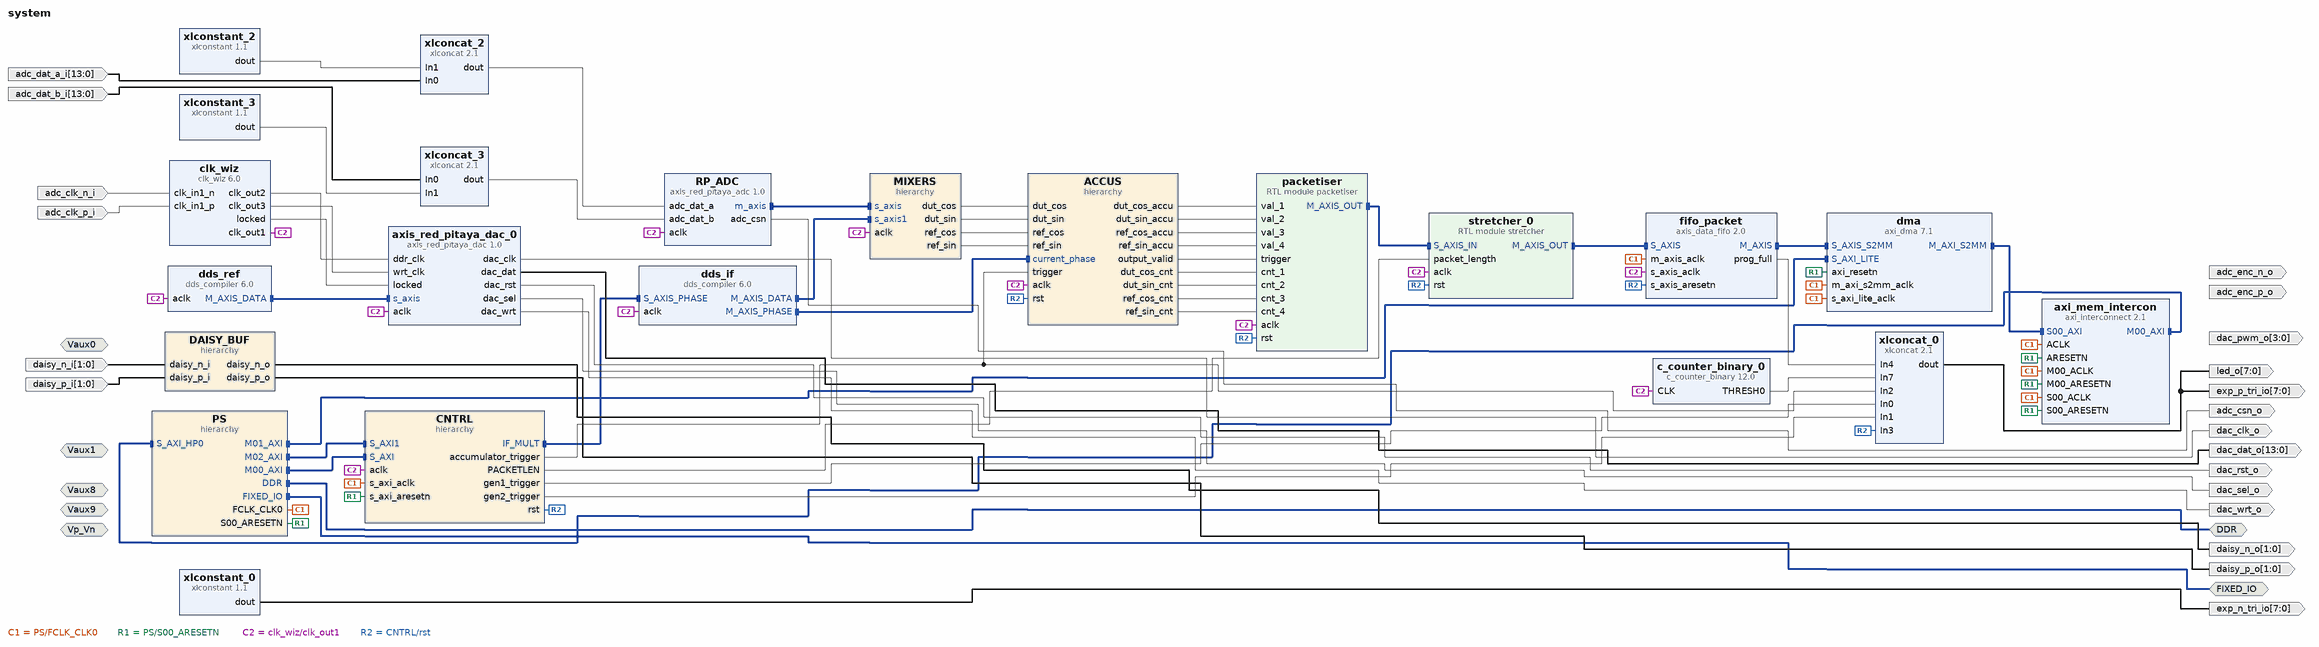
[diagram p0: block diagram of the top level]
# Vivado block design system, xc7z010iclg400-1L, Vivado 2023.2
create_bd_design system

create_bd_intf_port -mode Slave -vlnv xilinx.com:interface:diff_analog_io_rtl:1.0 Vp_Vn
create_bd_intf_port -mode Slave -vlnv xilinx.com:interface:diff_analog_io_rtl:1.0 Vaux0
create_bd_intf_port -mode Slave -vlnv xilinx.com:interface:diff_analog_io_rtl:1.0 Vaux1
create_bd_intf_port -mode Slave -vlnv xilinx.com:interface:diff_analog_io_rtl:1.0 Vaux9
create_bd_intf_port -mode Slave -vlnv xilinx.com:interface:diff_analog_io_rtl:1.0 Vaux8
create_bd_intf_port -mode Master -vlnv xilinx.com:interface:ddrx_rtl:1.0 DDR
create_bd_intf_port -mode Master -vlnv xilinx.com:display_processing_system7:fixedio_rtl:1.0 FIXED_IO
create_bd_port -dir I -from 13 -to 0 adc_dat_a_i
create_bd_port -dir I -from 13 -to 0 adc_dat_b_i
create_bd_port -dir I adc_clk_p_i
create_bd_port -dir I adc_clk_n_i
create_bd_port -dir O adc_enc_p_o
create_bd_port -dir O adc_enc_n_o
create_bd_port -dir O adc_csn_o
create_bd_port -dir O -from 13 -to 0 dac_dat_o
create_bd_port -dir O dac_clk_o
create_bd_port -dir O dac_rst_o
create_bd_port -dir O dac_sel_o
create_bd_port -dir O dac_wrt_o
create_bd_port -dir O -from 3 -to 0 dac_pwm_o
create_bd_port -dir O -from 1 -to 0 daisy_p_o
create_bd_port -dir O -from 1 -to 0 daisy_n_o
create_bd_port -dir I -from 1 -to 0 daisy_p_i
create_bd_port -dir I -from 1 -to 0 daisy_n_i
create_bd_port -dir O -from 7 -to 0 led_o
create_bd_port -dir O -from 7 -to 0 exp_n_tri_io
create_bd_port -dir O -from 7 -to 0 exp_p_tri_io

create_bd_cell -type ip -vlnv pavel-demin:user:axis_red_pitaya_adc:1.0 RP_ADC
create_bd_cell -type hier PS
create_bd_cell -type hier DAISY_BUF
create_bd_cell -type ip -vlnv xilinx.com:ip:axi_dma:7.1 dma
set_property -dict {CONFIG.c_include_mm2s 0 CONFIG.c_include_sg 0 CONFIG.c_m_axi_s2mm_data_width 64} [get_bd_cells dma]
create_bd_cell -type ip -vlnv xilinx.com:ip:axis_data_fifo:2.0 fifo_packet
set_property -dict [list \
  CONFIG.FIFO_DEPTH 32768 \
  CONFIG.FIFO_MODE 2 \
  CONFIG.HAS_PROG_FULL 1 \
  CONFIG.HAS_RD_DATA_COUNT 0 \
  CONFIG.HAS_WR_DATA_COUNT 0 \
  CONFIG.IS_ACLK_ASYNC 1 \
  CONFIG.PROG_FULL_THRESH 30000 \
] [get_bd_cells fifo_packet]
create_bd_cell -type ip -vlnv xilinx.com:ip:dds_compiler:6.0 dds_if
set_property -dict [list \
  CONFIG.DATA_Has_TLAST Not_Required \
  CONFIG.DDS_Clock_Rate 125 \
  CONFIG.Frequency_Resolution 488281 \
  CONFIG.Latency 5 \
  CONFIG.Mode_of_Operation Rasterized \
  CONFIG.Modulus 256 \
  CONFIG.Negative_Sine true \
  CONFIG.Noise_Shaping None \
  CONFIG.Output_Frequency1 0 \
  CONFIG.Output_Width 14 \
  CONFIG.PINC1 0 \
  CONFIG.Parameter_Entry Hardware_Parameters \
  CONFIG.Phase_Increment Streaming \
  CONFIG.Phase_Width 8 \
  CONFIG.S_PHASE_Has_TUSER Not_Required \
] [get_bd_cells dds_if]
create_bd_cell -type ip -vlnv xilinx.com:ip:dds_compiler:6.0 dds_ref
set_property -dict [list \
  CONFIG.DDS_Clock_Rate 125 \
  CONFIG.Frequency_Resolution 5000000 \
  CONFIG.Has_Phase_Out false \
  CONFIG.Latency 5 \
  CONFIG.M_DATA_Has_TUSER Not_Required \
  CONFIG.Mode_of_Operation Rasterized \
  CONFIG.Modulus 25 \
  CONFIG.Negative_Sine true \
  CONFIG.Noise_Shaping None \
  CONFIG.Output_Frequency1 0 \
  CONFIG.Output_Selection Sine_and_Cosine \
  CONFIG.Output_Width 14 \
  CONFIG.PINC1 10 \
  CONFIG.Parameter_Entry Hardware_Parameters \
  CONFIG.Phase_Width 5 \
] [get_bd_cells dds_ref]
create_bd_cell -type hier MIXERS
create_bd_cell -type hier ACCUS
create_bd_cell -type module -reference packetiser packetiser
create_bd_cell -type ip -vlnv xilinx.com:ip:xlconcat:2.1 xlconcat_0
set_property -dict [list \
  CONFIG.IN0_WIDTH 1 \
  CONFIG.IN1_WIDTH 1 \
  CONFIG.IN2_WIDTH 1 \
  CONFIG.IN3_WIDTH 1 \
  CONFIG.IN4_WIDTH 1 \
  CONFIG.IN5_WIDTH 1 \
  CONFIG.IN6_WIDTH 1 \
  CONFIG.IN7_WIDTH 1 \
  CONFIG.NUM_PORTS 8 \
  CONFIG.dout_width 8 \
] [get_bd_cells xlconcat_0]
create_bd_cell -type ip -vlnv xilinx.com:ip:axi_interconnect:2.1 axi_mem_intercon
set_property -dict {CONFIG.NUM_MI 1} [get_bd_cells axi_mem_intercon]
create_bd_cell -type hier CNTRL
create_bd_cell -type ip -vlnv xilinx.com:ip:c_counter_binary:12.0 c_counter_binary_0
set_property -dict [list \
  CONFIG.Final_Count_Value 18 \
  CONFIG.Latency_Configuration Manual \
  CONFIG.Output_Width 5 \
  CONFIG.Restrict_Count true \
  CONFIG.Sync_Threshold_Output true \
  CONFIG.Threshold_Value C \
] [get_bd_cells c_counter_binary_0]
create_bd_cell -type module -reference stretcher stretcher_0
create_bd_cell -type ip -vlnv xilinx.com:ip:xlconstant:1.1 xlconstant_0
set_property -dict {CONFIG.CONST_VAL 0 CONFIG.CONST_WIDTH 8} [get_bd_cells xlconstant_0]
create_bd_cell -type ip -vlnv xilinx.com:ip:clk_wiz:6.0 clk_wiz
set_property -dict [list \
  CONFIG.CLKIN1_JITTER_PS 80.0 \
  CONFIG.CLKOUT1_JITTER 119.348 \
  CONFIG.CLKOUT1_PHASE_ERROR 96.948 \
  CONFIG.CLKOUT1_REQUESTED_OUT_FREQ 125.000 \
  CONFIG.CLKOUT2_JITTER 104.759 \
  CONFIG.CLKOUT2_PHASE_ERROR 96.948 \
  CONFIG.CLKOUT2_REQUESTED_OUT_FREQ 250.000 \
  CONFIG.CLKOUT2_REQUESTED_PHASE 157.5 \
  CONFIG.CLKOUT2_USED true \
  CONFIG.CLKOUT3_JITTER 104.759 \
  CONFIG.CLKOUT3_PHASE_ERROR 96.948 \
  CONFIG.CLKOUT3_REQUESTED_OUT_FREQ 250.000 \
  CONFIG.CLKOUT3_REQUESTED_PHASE 202.5 \
  CONFIG.CLKOUT3_USED true \
  CONFIG.MMCM_CLKFBOUT_MULT_F 8.000 \
  CONFIG.MMCM_CLKIN1_PERIOD 8.000 \
  CONFIG.MMCM_CLKOUT0_DIVIDE_F 8.000 \
  CONFIG.MMCM_CLKOUT1_DIVIDE 4 \
  CONFIG.MMCM_CLKOUT1_PHASE 157.500 \
  CONFIG.MMCM_CLKOUT2_DIVIDE 4 \
  CONFIG.MMCM_CLKOUT2_PHASE 202.500 \
  CONFIG.NUM_OUT_CLKS 3 \
  CONFIG.PRIM_IN_FREQ 125.000 \
  CONFIG.PRIM_SOURCE Differential_clock_capable_pin \
  CONFIG.USE_RESET false \
] [get_bd_cells clk_wiz]
create_bd_cell -type ip -vlnv pavel-demin:user:axis_red_pitaya_dac:1.0 axis_red_pitaya_dac_0
create_bd_cell -type ip -vlnv xilinx.com:ip:xlconcat:2.1 xlconcat_2
create_bd_cell -type ip -vlnv xilinx.com:ip:xlconstant:1.1 xlconstant_2
set_property -dict {CONFIG.CONST_VAL 0 CONFIG.CONST_WIDTH 2} [get_bd_cells xlconstant_2]
create_bd_cell -type ip -vlnv xilinx.com:ip:xlconcat:2.1 xlconcat_3
create_bd_cell -type ip -vlnv xilinx.com:ip:xlconstant:1.1 xlconstant_3
set_property -dict {CONFIG.CONST_VAL 0 CONFIG.CONST_WIDTH 2} [get_bd_cells xlconstant_3]

# ---- hierarchy /PS ----
current_bd_instance /PS
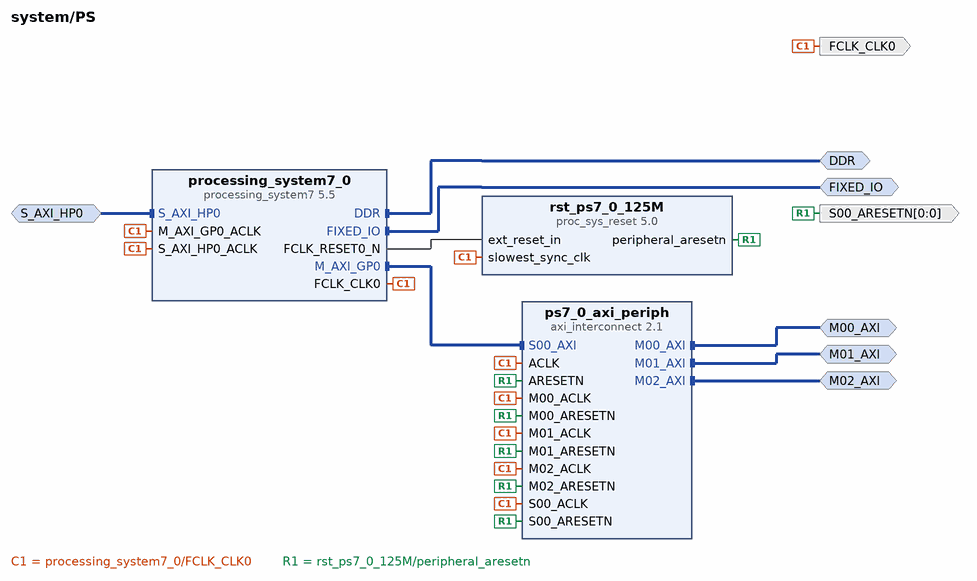
[diagram p1: block diagram inside /PS]
create_bd_intf_pin -mode Master -vlnv xilinx.com:interface:ddrx_rtl:1.0 DDR
create_bd_intf_pin -mode Master -vlnv xilinx.com:display_processing_system7:fixedio_rtl:1.0 FIXED_IO
create_bd_intf_pin -mode Master -vlnv xilinx.com:interface:aximm_rtl:1.0 M00_AXI
create_bd_intf_pin -mode Master -vlnv xilinx.com:interface:aximm_rtl:1.0 M01_AXI
create_bd_intf_pin -mode Slave -vlnv xilinx.com:interface:aximm_rtl:1.0 S_AXI_HP0
create_bd_intf_pin -mode Master -vlnv xilinx.com:interface:aximm_rtl:1.0 M02_AXI
create_bd_pin -dir O -type clk FCLK_CLK0
create_bd_pin -dir O -from 0 -to 0 -type rst S00_ARESETN

create_bd_cell -type ip -vlnv xilinx.com:ip:processing_system7:5.5 processing_system7_0
set_property -dict [list \
  CONFIG.PCW_APU_PERIPHERAL_FREQMHZ 666.666666 \
  CONFIG.PCW_DM_WIDTH 2 \
  CONFIG.PCW_DQS_WIDTH 2 \
  CONFIG.PCW_DQ_WIDTH 16 \
  CONFIG.PCW_ENET0_ENET0_IO EMIO \
  CONFIG.PCW_ENET0_GRP_MDIO_ENABLE 1 \
  CONFIG.PCW_ENET0_GRP_MDIO_IO EMIO \
  CONFIG.PCW_ENET0_PERIPHERAL_ENABLE 1 \
  CONFIG.PCW_ENET0_RESET_ENABLE 0 \
  CONFIG.PCW_ENET_RESET_ENABLE 1 \
  CONFIG.PCW_ENET_RESET_SELECT {Share reset pin} \
  CONFIG.PCW_FPGA0_PERIPHERAL_FREQMHZ 125 \
  CONFIG.PCW_FPGA1_PERIPHERAL_FREQMHZ 250 \
  CONFIG.PCW_FPGA3_PERIPHERAL_FREQMHZ 200 \
  CONFIG.PCW_GPIO_MIO_GPIO_ENABLE 1 \
  CONFIG.PCW_GPIO_MIO_GPIO_IO MIO \
  CONFIG.PCW_GPIO_PERIPHERAL_ENABLE 1 \
  CONFIG.PCW_I2C0_I2C0_IO EMIO \
  CONFIG.PCW_I2C0_PERIPHERAL_ENABLE 1 \
  CONFIG.PCW_I2C_PERIPHERAL_FREQMHZ 111.111115 \
  CONFIG.PCW_I2C_RESET_ENABLE 1 \
  CONFIG.PCW_I2C_RESET_SELECT {Share reset pin} \
  CONFIG.PCW_IMPORT_BOARD_PRESET cfg/red_pitaya.xml \
  CONFIG.PCW_MIO_PRIMITIVE 32 \
  CONFIG.PCW_PERIPHERAL_BOARD_PRESET None \
  CONFIG.PCW_PRESET_BANK1_VOLTAGE {LVCMOS 2.5V} \
  CONFIG.PCW_QSPI_GRP_SINGLE_SS_ENABLE 1 \
  CONFIG.PCW_QSPI_GRP_SINGLE_SS_IO {MIO 1 .. 6} \
  CONFIG.PCW_QSPI_PERIPHERAL_ENABLE 1 \
  CONFIG.PCW_QSPI_PERIPHERAL_FREQMHZ 125 \
  CONFIG.PCW_QSPI_QSPI_IO {MIO 1 .. 6} \
  CONFIG.PCW_SD0_PERIPHERAL_ENABLE 1 \
  CONFIG.PCW_SD0_SD0_IO EMIO \
  CONFIG.PCW_SDIO_PERIPHERAL_FREQMHZ 100 \
  CONFIG.PCW_SINGLE_QSPI_DATA_MODE x4 \
  CONFIG.PCW_SPI0_PERIPHERAL_ENABLE 1 \
  CONFIG.PCW_SPI0_SPI0_IO EMIO \
  CONFIG.PCW_SPI1_PERIPHERAL_ENABLE 1 \
  CONFIG.PCW_SPI1_SPI1_IO {MIO 10 .. 15} \
  CONFIG.PCW_TTC0_PERIPHERAL_ENABLE 1 \
  CONFIG.PCW_TTC0_TTC0_IO EMIO \
  CONFIG.PCW_UART0_PERIPHERAL_ENABLE 1 \
  CONFIG.PCW_UART0_UART0_IO {MIO 14 .. 15} \
  CONFIG.PCW_UART1_PERIPHERAL_ENABLE 1 \
  CONFIG.PCW_UART1_UART1_IO {MIO 8 .. 9} \
  CONFIG.PCW_UART_PERIPHERAL_FREQMHZ 100 \
  CONFIG.PCW_UIPARAM_DDR_BUS_WIDTH {16 Bit} \
  CONFIG.PCW_UIPARAM_DDR_FREQ_MHZ 533.333333 \
  CONFIG.PCW_UIPARAM_DDR_PARTNO {MT41J256M16 RE-125} \
  CONFIG.PCW_USB0_PERIPHERAL_ENABLE 1 \
  CONFIG.PCW_USB0_RESET_ENABLE 1 \
  CONFIG.PCW_USB0_RESET_IO {MIO 48} \
  CONFIG.PCW_USB0_USB0_IO {MIO 28 .. 39} \
  CONFIG.PCW_USB_RESET_ENABLE 1 \
  CONFIG.PCW_USB_RESET_SELECT {Share reset pin} \
  CONFIG.PCW_USE_S_AXI_HP0 1 \
] [get_bd_cells processing_system7_0]
# 505 more settings of processing_system7_0 are not shown: defaults, MIO pin electricals, DDR timing, and values the tool derives
create_bd_cell -type ip -vlnv xilinx.com:ip:proc_sys_reset:5.0 rst_ps7_0_125M
create_bd_cell -type ip -vlnv xilinx.com:ip:axi_interconnect:2.1 ps7_0_axi_periph
set_property -dict {CONFIG.NUM_MI 3} [get_bd_cells ps7_0_axi_periph]

# ---- hierarchy /DAISY_BUF ----
current_bd_instance /DAISY_BUF
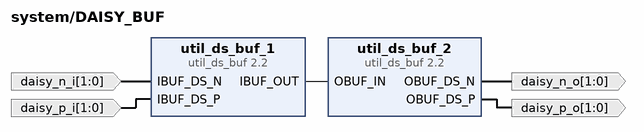
[diagram p2: block diagram inside /DAISY_BUF]
create_bd_pin -dir I -from 1 -to 0 daisy_p_i
create_bd_pin -dir I -from 1 -to 0 daisy_n_i
create_bd_pin -dir O -from 1 -to 0 -type clk daisy_p_o
create_bd_pin -dir O -from 1 -to 0 -type clk daisy_n_o

create_bd_cell -type ip -vlnv xilinx.com:ip:util_ds_buf:2.2 util_ds_buf_1
set_property -dict {CONFIG.C_SIZE 2} [get_bd_cells util_ds_buf_1]
create_bd_cell -type ip -vlnv xilinx.com:ip:util_ds_buf:2.2 util_ds_buf_2
set_property -dict {CONFIG.C_BUF_TYPE OBUFDS CONFIG.C_SIZE 2} [get_bd_cells util_ds_buf_2]

# ---- hierarchy /MIXERS ----
current_bd_instance /MIXERS
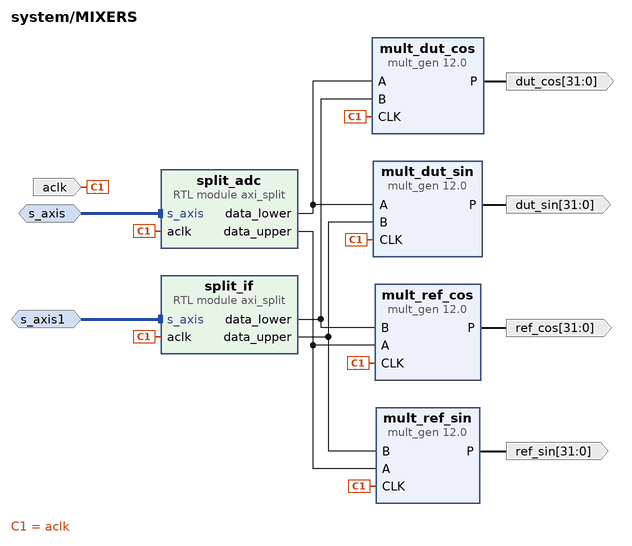
[diagram p3: block diagram inside /MIXERS]
create_bd_intf_pin -mode Slave -vlnv xilinx.com:interface:axis_rtl:1.0 s_axis
create_bd_intf_pin -mode Slave -vlnv xilinx.com:interface:axis_rtl:1.0 s_axis1
create_bd_pin -dir I -type clk aclk
create_bd_pin -dir O -from 31 -to 0 -type data dut_cos
create_bd_pin -dir O -from 31 -to 0 -type data ref_cos
create_bd_pin -dir O -from 31 -to 0 -type data ref_sin
create_bd_pin -dir O -from 31 -to 0 -type data dut_sin

create_bd_cell -type module -reference axi_split split_adc
create_bd_cell -type module -reference axi_split split_if
create_bd_cell -type ip -vlnv xilinx.com:ip:mult_gen:12.0 mult_ref_cos
set_property -dict [list \
  CONFIG.Multiplier_Construction Use_Mults \
  CONFIG.OptGoal Speed \
  CONFIG.OutputWidthHigh 31 \
  CONFIG.PipeStages 3 \
  CONFIG.PortAType Signed \
  CONFIG.PortAWidth 14 \
  CONFIG.PortBType Signed \
  CONFIG.PortBWidth 14 \
  CONFIG.Use_Custom_Output_Width true \
] [get_bd_cells mult_ref_cos]
create_bd_cell -type ip -vlnv xilinx.com:ip:mult_gen:12.0 mult_ref_sin
set_property -dict [list \
  CONFIG.Multiplier_Construction Use_Mults \
  CONFIG.OptGoal Speed \
  CONFIG.OutputWidthHigh 31 \
  CONFIG.PipeStages 3 \
  CONFIG.PortAType Signed \
  CONFIG.PortAWidth 14 \
  CONFIG.PortBType Signed \
  CONFIG.PortBWidth 14 \
  CONFIG.Use_Custom_Output_Width true \
] [get_bd_cells mult_ref_sin]
create_bd_cell -type ip -vlnv xilinx.com:ip:mult_gen:12.0 mult_dut_cos
set_property -dict [list \
  CONFIG.Multiplier_Construction Use_Mults \
  CONFIG.OptGoal Speed \
  CONFIG.OutputWidthHigh 31 \
  CONFIG.PipeStages 3 \
  CONFIG.PortAType Signed \
  CONFIG.PortAWidth 14 \
  CONFIG.PortBType Signed \
  CONFIG.PortBWidth 14 \
  CONFIG.Use_Custom_Output_Width true \
] [get_bd_cells mult_dut_cos]
create_bd_cell -type ip -vlnv xilinx.com:ip:mult_gen:12.0 mult_dut_sin
set_property -dict [list \
  CONFIG.Multiplier_Construction Use_Mults \
  CONFIG.OptGoal Speed \
  CONFIG.OutputWidthHigh 31 \
  CONFIG.PipeStages 3 \
  CONFIG.PortAType Signed \
  CONFIG.PortAWidth 14 \
  CONFIG.PortBType Signed \
  CONFIG.PortBWidth 14 \
  CONFIG.Use_Custom_Output_Width true \
] [get_bd_cells mult_dut_sin]

# ---- hierarchy /ACCUS ----
current_bd_instance /ACCUS
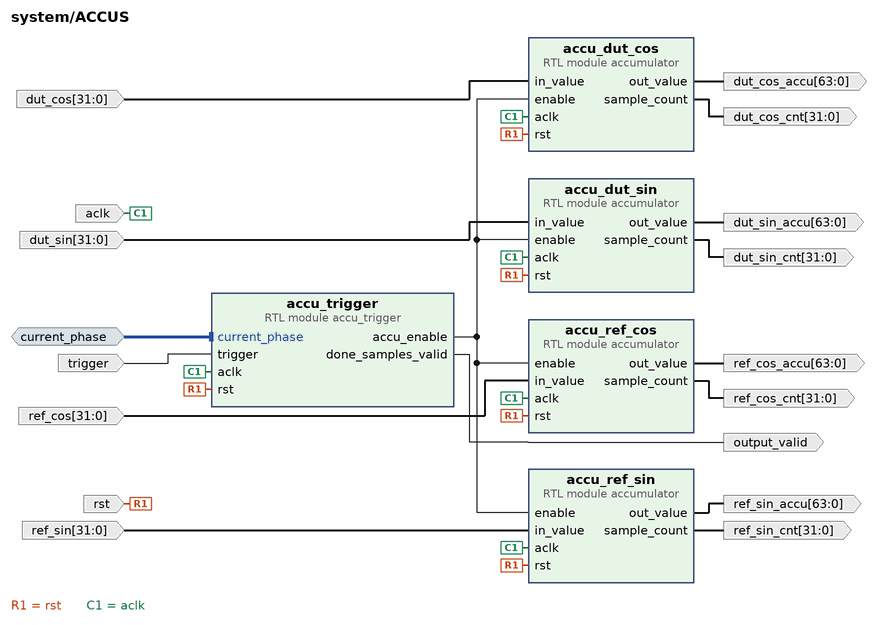
[diagram p4: block diagram inside /ACCUS]
create_bd_intf_pin -mode Slave -vlnv xilinx.com:interface:axis_rtl:1.0 current_phase
create_bd_pin -dir I -type clk aclk
create_bd_pin -dir O -from 63 -to 0 dut_cos_accu
create_bd_pin -dir O -from 31 -to 0 dut_cos_cnt
create_bd_pin -dir O -from 63 -to 0 dut_sin_accu
create_bd_pin -dir O -from 31 -to 0 dut_sin_cnt
create_bd_pin -dir O -from 63 -to 0 ref_cos_accu
create_bd_pin -dir O -from 31 -to 0 ref_cos_cnt
create_bd_pin -dir O -from 63 -to 0 ref_sin_accu
create_bd_pin -dir O -from 31 -to 0 ref_sin_cnt
create_bd_pin -dir O output_valid
create_bd_pin -dir I -from 31 -to 0 -type data dut_cos
create_bd_pin -dir I -from 31 -to 0 -type data dut_sin
create_bd_pin -dir I -from 31 -to 0 -type data ref_cos
create_bd_pin -dir I -from 31 -to 0 -type data ref_sin
create_bd_pin -dir I -type rst rst
create_bd_pin -dir I trigger

create_bd_cell -type module -reference accumulator accu_dut_cos
create_bd_cell -type module -reference accumulator accu_dut_sin
create_bd_cell -type module -reference accumulator accu_ref_sin
create_bd_cell -type module -reference accu_trigger accu_trigger
create_bd_cell -type module -reference accumulator accu_ref_cos

# ---- hierarchy /CNTRL ----
current_bd_instance /CNTRL
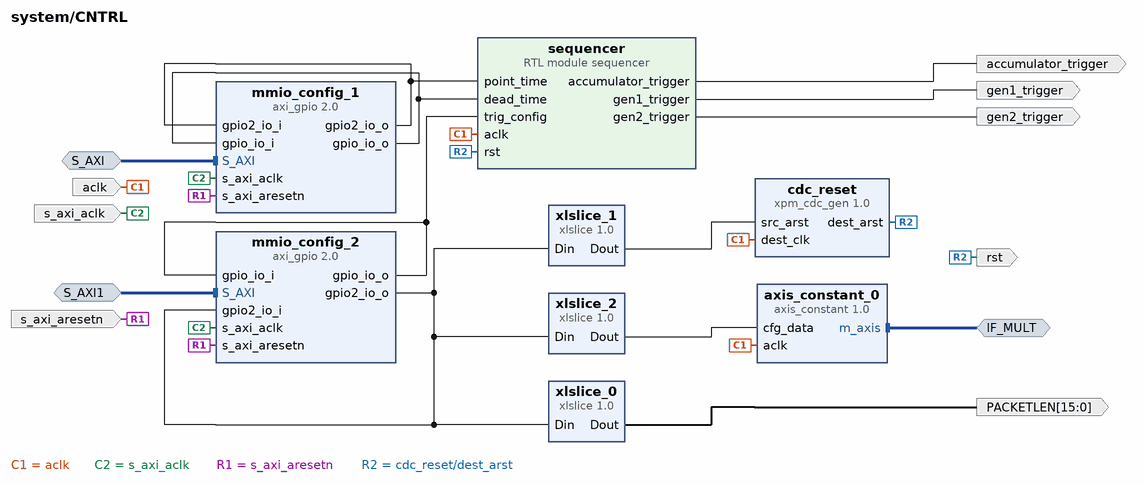
[diagram p5: block diagram inside /CNTRL]
create_bd_intf_pin -mode Slave -vlnv xilinx.com:interface:aximm_rtl:1.0 S_AXI
create_bd_intf_pin -mode Slave -vlnv xilinx.com:interface:aximm_rtl:1.0 S_AXI1
create_bd_intf_pin -mode Master -vlnv xilinx.com:interface:axis_rtl:1.0 IF_MULT
create_bd_pin -dir I -type clk aclk
create_bd_pin -dir O -type rst rst
create_bd_pin -dir I -type clk s_axi_aclk
create_bd_pin -dir I -type rst s_axi_aresetn
create_bd_pin -dir O gen1_trigger
create_bd_pin -dir O gen2_trigger
create_bd_pin -dir O accumulator_trigger
create_bd_pin -dir O -from 15 -to 0 PACKETLEN

create_bd_cell -type ip -vlnv xilinx.com:ip:xlslice:1.0 xlslice_1
create_bd_cell -type ip -vlnv xilinx.com:ip:xpm_cdc_gen:1.0 cdc_reset
set_property -dict {CONFIG.CDC_TYPE xpm_cdc_async_rst CONFIG.INIT_SYNC_FF false} [get_bd_cells cdc_reset]
create_bd_cell -type ip -vlnv xilinx.com:ip:axi_gpio:2.0 mmio_config_1
set_property -dict [list \
  CONFIG.C_ALL_INPUTS_2 0 \
  CONFIG.C_ALL_OUTPUTS_2 0 \
  CONFIG.C_DOUT_DEFAULT 0x00007A12 \
  CONFIG.C_DOUT_DEFAULT_2 0x0001E848 \
  CONFIG.C_IS_DUAL 1 \
] [get_bd_cells mmio_config_1]
create_bd_cell -type ip -vlnv xilinx.com:ip:axi_gpio:2.0 mmio_config_2
set_property -dict [list \
  CONFIG.C_DOUT_DEFAULT 0x250004E2 \
  CONFIG.C_DOUT_DEFAULT_2 0x00011000 \
  CONFIG.C_IS_DUAL 1 \
] [get_bd_cells mmio_config_2]
create_bd_cell -type module -reference sequencer sequencer
create_bd_cell -type ip -vlnv xilinx.com:ip:xlslice:1.0 xlslice_0
set_property -dict {CONFIG.DIN_FROM 31 CONFIG.DIN_TO 16 CONFIG.DOUT_WIDTH 16} [get_bd_cells xlslice_0]
create_bd_cell -type ip -vlnv xilinx.com:ip:xlslice:1.0 xlslice_2
set_property -dict {CONFIG.DIN_FROM 15 CONFIG.DIN_TO 8 CONFIG.DOUT_WIDTH 8} [get_bd_cells xlslice_2]
create_bd_cell -type ip -vlnv pavel-demin:user:axis_constant:1.0 axis_constant_0
set_property -dict {CONFIG.AXIS_TDATA_WIDTH 8} [get_bd_cells axis_constant_0]

# ---- connections ----

current_bd_instance /PS
connect_bd_intf_net [get_bd_intf_pins ps7_0_axi_periph/M01_AXI] [get_bd_intf_pins M01_AXI]
connect_bd_intf_net [get_bd_intf_pins processing_system7_0/S_AXI_HP0] [get_bd_intf_pins S_AXI_HP0]
connect_bd_intf_net [get_bd_intf_pins ps7_0_axi_periph/M02_AXI] [get_bd_intf_pins M02_AXI]
connect_bd_intf_net [get_bd_intf_pins DDR] [get_bd_intf_pins processing_system7_0/DDR]
connect_bd_intf_net [get_bd_intf_pins FIXED_IO] [get_bd_intf_pins processing_system7_0/FIXED_IO]
connect_bd_intf_net [get_bd_intf_pins processing_system7_0/M_AXI_GP0] [get_bd_intf_pins ps7_0_axi_periph/S00_AXI]
connect_bd_intf_net [get_bd_intf_pins M00_AXI] [get_bd_intf_pins ps7_0_axi_periph/M00_AXI]
connect_bd_net [get_bd_pins processing_system7_0/FCLK_CLK0] \
  [get_bd_pins FCLK_CLK0] [get_bd_pins processing_system7_0/M_AXI_GP0_ACLK] [get_bd_pins processing_system7_0/S_AXI_HP0_ACLK] \
  [get_bd_pins ps7_0_axi_periph/ACLK] [get_bd_pins ps7_0_axi_periph/S00_ACLK] [get_bd_pins ps7_0_axi_periph/M00_ACLK] \
  [get_bd_pins ps7_0_axi_periph/M01_ACLK] [get_bd_pins ps7_0_axi_periph/M02_ACLK] \
  [get_bd_pins rst_ps7_0_125M/slowest_sync_clk]
connect_bd_net [get_bd_pins processing_system7_0/FCLK_RESET0_N] [get_bd_pins rst_ps7_0_125M/ext_reset_in]
connect_bd_net [get_bd_pins rst_ps7_0_125M/peripheral_aresetn] \
  [get_bd_pins S00_ARESETN] [get_bd_pins ps7_0_axi_periph/ARESETN] [get_bd_pins ps7_0_axi_periph/S00_ARESETN] \
  [get_bd_pins ps7_0_axi_periph/M00_ARESETN] [get_bd_pins ps7_0_axi_periph/M01_ARESETN] \
  [get_bd_pins ps7_0_axi_periph/M02_ARESETN]

current_bd_instance /DAISY_BUF
connect_bd_net [get_bd_pins daisy_n_i] [get_bd_pins util_ds_buf_1/IBUF_DS_N]
connect_bd_net [get_bd_pins daisy_p_i] [get_bd_pins util_ds_buf_1/IBUF_DS_P]
connect_bd_net [get_bd_pins util_ds_buf_1/IBUF_OUT] [get_bd_pins util_ds_buf_2/OBUF_IN]
connect_bd_net [get_bd_pins util_ds_buf_2/OBUF_DS_N] [get_bd_pins daisy_n_o]
connect_bd_net [get_bd_pins util_ds_buf_2/OBUF_DS_P] [get_bd_pins daisy_p_o]

current_bd_instance /MIXERS
connect_bd_intf_net -intf_net RP_ADC_M_AXIS [get_bd_intf_pins s_axis] [get_bd_intf_pins split_adc/s_axis]
connect_bd_intf_net -intf_net dds_if_M_AXIS_DATA [get_bd_intf_pins s_axis1] [get_bd_intf_pins split_if/s_axis]
connect_bd_net -net axis_red_pitaya_adc_0_adc_clk [get_bd_pins aclk] \
  [get_bd_pins mult_dut_cos/CLK] [get_bd_pins mult_dut_sin/CLK] [get_bd_pins mult_ref_cos/CLK] [get_bd_pins mult_ref_sin/CLK] \
  [get_bd_pins split_adc/aclk] [get_bd_pins split_if/aclk]
connect_bd_net [get_bd_pins mult_dut_cos/P] [get_bd_pins dut_cos]
connect_bd_net [get_bd_pins mult_dut_sin/P] [get_bd_pins dut_sin]
connect_bd_net [get_bd_pins mult_ref_cos/P] [get_bd_pins ref_cos]
connect_bd_net [get_bd_pins mult_ref_sin/P] [get_bd_pins ref_sin]
connect_bd_net [get_bd_pins split_adc/data_lower] [get_bd_pins mult_dut_cos/A] [get_bd_pins mult_dut_sin/A]
connect_bd_net [get_bd_pins split_adc/data_upper] [get_bd_pins mult_ref_cos/A] [get_bd_pins mult_ref_sin/A]
connect_bd_net [get_bd_pins split_if/data_lower] [get_bd_pins mult_dut_cos/B] [get_bd_pins mult_ref_cos/B]
connect_bd_net [get_bd_pins split_if/data_upper] [get_bd_pins mult_dut_sin/B] [get_bd_pins mult_ref_sin/B]

current_bd_instance /ACCUS
connect_bd_intf_net [get_bd_intf_pins accu_trigger/current_phase] [get_bd_intf_pins current_phase]
connect_bd_net [get_bd_pins rst] \
  [get_bd_pins accu_dut_cos/rst] [get_bd_pins accu_dut_sin/rst] [get_bd_pins accu_ref_cos/rst] [get_bd_pins accu_ref_sin/rst] \
  [get_bd_pins accu_trigger/rst]
connect_bd_net -net accu_trigger_0_accu_enable [get_bd_pins accu_trigger/accu_enable] \
  [get_bd_pins accu_dut_cos/enable] [get_bd_pins accu_dut_sin/enable] [get_bd_pins accu_ref_cos/enable] \
  [get_bd_pins accu_ref_sin/enable]
connect_bd_net -net accu_trigger_0_done_samples_valid [get_bd_pins accu_trigger/done_samples_valid] [get_bd_pins output_valid]
connect_bd_net -net accumulator_0_out_value [get_bd_pins accu_dut_cos/out_value] [get_bd_pins dut_cos_accu]
connect_bd_net -net accumulator_0_sample_count [get_bd_pins accu_dut_cos/sample_count] [get_bd_pins dut_cos_cnt]
connect_bd_net -net accumulator_1_out_value [get_bd_pins accu_dut_sin/out_value] [get_bd_pins dut_sin_accu]
connect_bd_net -net accumulator_1_sample_count [get_bd_pins accu_dut_sin/sample_count] [get_bd_pins dut_sin_cnt]
connect_bd_net -net accumulator_2_out_value [get_bd_pins accu_ref_cos/out_value] [get_bd_pins ref_cos_accu]
connect_bd_net -net accumulator_2_sample_count [get_bd_pins accu_ref_cos/sample_count] [get_bd_pins ref_cos_cnt]
connect_bd_net -net accumulator_3_out_value [get_bd_pins accu_ref_sin/out_value] [get_bd_pins ref_sin_accu]
connect_bd_net -net accumulator_3_sample_count [get_bd_pins accu_ref_sin/sample_count] [get_bd_pins ref_sin_cnt]
connect_bd_net [get_bd_pins aclk] \
  [get_bd_pins accu_dut_cos/aclk] [get_bd_pins accu_dut_sin/aclk] [get_bd_pins accu_ref_cos/aclk] \
  [get_bd_pins accu_ref_sin/aclk] [get_bd_pins accu_trigger/aclk]
connect_bd_net -net in_value1_1 [get_bd_pins dut_sin] [get_bd_pins accu_dut_sin/in_value]
connect_bd_net -net in_value2_1 [get_bd_pins ref_cos] [get_bd_pins accu_ref_cos/in_value]
connect_bd_net -net in_value3_1 [get_bd_pins ref_sin] [get_bd_pins accu_ref_sin/in_value]
connect_bd_net -net in_value_1 [get_bd_pins dut_cos] [get_bd_pins accu_dut_cos/in_value]
connect_bd_net [get_bd_pins trigger] [get_bd_pins accu_trigger/trigger]

current_bd_instance /CNTRL
connect_bd_intf_net [get_bd_intf_pins axis_constant_0/m_axis] [get_bd_intf_pins IF_MULT]
connect_bd_intf_net -intf_net PS_M02_AXI [get_bd_intf_pins S_AXI1] [get_bd_intf_pins mmio_config_2/S_AXI]
connect_bd_intf_net [get_bd_intf_pins S_AXI] [get_bd_intf_pins mmio_config_1/S_AXI]
connect_bd_net -net axi_gpio_0_gpio_io_o [get_bd_pins mmio_config_2/gpio_io_o] \
  [get_bd_pins mmio_config_2/gpio_io_i] [get_bd_pins sequencer/trig_config]
connect_bd_net -net axis_red_pitaya_adc_0_adc_clk [get_bd_pins aclk] \
  [get_bd_pins axis_constant_0/aclk] [get_bd_pins cdc_reset/dest_clk] [get_bd_pins sequencer/aclk]
connect_bd_net -net gpio_seq_config_gpio2_io_o [get_bd_pins mmio_config_1/gpio2_io_o] \
  [get_bd_pins mmio_config_1/gpio2_io_i] [get_bd_pins sequencer/point_time]
connect_bd_net -net gpio_seq_config_gpio_io_o [get_bd_pins mmio_config_1/gpio_io_o] \
  [get_bd_pins mmio_config_1/gpio_io_i] [get_bd_pins sequencer/dead_time]
connect_bd_net [get_bd_pins mmio_config_2/gpio2_io_o] \
  [get_bd_pins mmio_config_2/gpio2_io_i] [get_bd_pins xlslice_0/Din] [get_bd_pins xlslice_1/Din] [get_bd_pins xlslice_2/Din]
connect_bd_net -net processing_system7_0_FCLK_CLK0 [get_bd_pins s_axi_aclk] \
  [get_bd_pins mmio_config_1/s_axi_aclk] [get_bd_pins mmio_config_2/s_axi_aclk]
connect_bd_net -net rst_ps7_0_125M_peripheral_aresetn [get_bd_pins s_axi_aresetn] \
  [get_bd_pins mmio_config_1/s_axi_aresetn] [get_bd_pins mmio_config_2/s_axi_aresetn]
connect_bd_net -net sequencer_0_generator_trigger [get_bd_pins sequencer/gen1_trigger] [get_bd_pins gen1_trigger]
connect_bd_net [get_bd_pins sequencer/accumulator_trigger] [get_bd_pins accumulator_trigger]
connect_bd_net -net sequencer_generator_sweep_trigger [get_bd_pins sequencer/gen2_trigger] [get_bd_pins gen2_trigger]
connect_bd_net [get_bd_pins xlslice_0/Dout] [get_bd_pins PACKETLEN]
connect_bd_net [get_bd_pins xlslice_1/Dout] [get_bd_pins cdc_reset/src_arst]
connect_bd_net [get_bd_pins xlslice_2/Dout] [get_bd_pins axis_constant_0/cfg_data]
connect_bd_net -net xpm_cdc_gen_0_dest_out [get_bd_pins cdc_reset/dest_arst] [get_bd_pins rst] [get_bd_pins sequencer/rst]

current_bd_instance /
connect_bd_intf_net -intf_net CNTRL_M_AXIS [get_bd_intf_pins dds_if/S_AXIS_PHASE] [get_bd_intf_pins CNTRL/IF_MULT]
connect_bd_intf_net [get_bd_intf_pins dma/S_AXI_LITE] [get_bd_intf_pins PS/M01_AXI]
connect_bd_intf_net [get_bd_intf_pins CNTRL/S_AXI1] [get_bd_intf_pins PS/M02_AXI]
connect_bd_intf_net [get_bd_intf_pins MIXERS/s_axis] [get_bd_intf_pins RP_ADC/m_axis]
connect_bd_intf_net [get_bd_intf_pins axi_mem_intercon/M00_AXI] [get_bd_intf_pins PS/S_AXI_HP0]
connect_bd_intf_net -intf_net axis_data_fifo_0_M_AXIS [get_bd_intf_pins fifo_packet/M_AXIS] [get_bd_intf_pins dma/S_AXIS_S2MM]
connect_bd_intf_net [get_bd_intf_pins dds_if/M_AXIS_DATA] [get_bd_intf_pins MIXERS/s_axis1]
connect_bd_intf_net [get_bd_intf_pins dds_if/M_AXIS_PHASE] [get_bd_intf_pins ACCUS/current_phase]
connect_bd_intf_net [get_bd_intf_pins dds_ref/M_AXIS_DATA] [get_bd_intf_pins axis_red_pitaya_dac_0/s_axis]
connect_bd_intf_net [get_bd_intf_pins dma/M_AXI_S2MM] [get_bd_intf_pins axi_mem_intercon/S00_AXI]
connect_bd_intf_net [get_bd_intf_pins stretcher_0/S_AXIS_IN] [get_bd_intf_pins packetiser/M_AXIS_OUT]
connect_bd_intf_net -intf_net processing_system7_0_DDR [get_bd_intf_ports DDR] [get_bd_intf_pins PS/DDR]
connect_bd_intf_net -intf_net processing_system7_0_FIXED_IO [get_bd_intf_ports FIXED_IO] [get_bd_intf_pins PS/FIXED_IO]
connect_bd_intf_net [get_bd_intf_pins PS/M00_AXI] [get_bd_intf_pins CNTRL/S_AXI]
connect_bd_intf_net [get_bd_intf_pins stretcher_0/M_AXIS_OUT] [get_bd_intf_pins fifo_packet/S_AXIS]
connect_bd_net -net ACCUS_out_value [get_bd_pins ACCUS/dut_cos_accu] [get_bd_pins packetiser/val_1]
connect_bd_net -net ACCUS_out_value1 [get_bd_pins ACCUS/dut_sin_accu] [get_bd_pins packetiser/val_2]
connect_bd_net -net ACCUS_out_value2 [get_bd_pins ACCUS/ref_cos_accu] [get_bd_pins packetiser/val_3]
connect_bd_net -net ACCUS_out_value3 [get_bd_pins ACCUS/ref_sin_accu] [get_bd_pins packetiser/val_4]
connect_bd_net [get_bd_pins ACCUS/output_valid] [get_bd_pins packetiser/trigger]
connect_bd_net -net ACCUS_sample_count [get_bd_pins ACCUS/dut_cos_cnt] [get_bd_pins packetiser/cnt_1]
connect_bd_net -net ACCUS_sample_count1 [get_bd_pins ACCUS/dut_sin_cnt] [get_bd_pins packetiser/cnt_2]
connect_bd_net -net ACCUS_sample_count2 [get_bd_pins ACCUS/ref_cos_cnt] [get_bd_pins packetiser/cnt_3]
connect_bd_net -net ACCUS_sample_count3 [get_bd_pins ACCUS/ref_sin_cnt] [get_bd_pins packetiser/cnt_4]
connect_bd_net [get_bd_pins CNTRL/PACKETLEN] [get_bd_pins stretcher_0/packet_length]
connect_bd_net -net MIXERS_P [get_bd_pins MIXERS/dut_cos] [get_bd_pins ACCUS/dut_cos]
connect_bd_net -net MIXERS_P1 [get_bd_pins MIXERS/dut_sin] [get_bd_pins ACCUS/dut_sin]
connect_bd_net -net MIXERS_P2 [get_bd_pins MIXERS/ref_cos] [get_bd_pins ACCUS/ref_cos]
connect_bd_net -net MIXERS_P3 [get_bd_pins MIXERS/ref_sin] [get_bd_pins ACCUS/ref_sin]
connect_bd_net -net adc_clk_n_1 [get_bd_ports adc_clk_n_i] [get_bd_pins clk_wiz/clk_in1_n]
connect_bd_net -net adc_clk_p_1 [get_bd_ports adc_clk_p_i] [get_bd_pins clk_wiz/clk_in1_p]
connect_bd_net [get_bd_ports adc_dat_a_i] [get_bd_pins xlconcat_2/In0]
connect_bd_net [get_bd_ports adc_dat_b_i] [get_bd_pins xlconcat_3/In0]
connect_bd_net -net axis_red_pitaya_adc_0_adc_csn [get_bd_pins RP_ADC/adc_csn] [get_bd_ports adc_csn_o]
connect_bd_net [get_bd_pins axis_red_pitaya_dac_0/dac_clk] [get_bd_ports dac_clk_o]
connect_bd_net [get_bd_pins axis_red_pitaya_dac_0/dac_dat] [get_bd_ports dac_dat_o]
connect_bd_net [get_bd_pins axis_red_pitaya_dac_0/dac_rst] [get_bd_ports dac_rst_o]
connect_bd_net [get_bd_pins axis_red_pitaya_dac_0/dac_sel] [get_bd_ports dac_sel_o]
connect_bd_net [get_bd_pins axis_red_pitaya_dac_0/dac_wrt] [get_bd_ports dac_wrt_o]
connect_bd_net [get_bd_pins c_counter_binary_0/THRESH0] [get_bd_pins xlconcat_0/In7]
connect_bd_net [get_bd_pins clk_wiz/clk_out2] [get_bd_pins axis_red_pitaya_dac_0/ddr_clk]
connect_bd_net [get_bd_pins clk_wiz/clk_out3] [get_bd_pins axis_red_pitaya_dac_0/wrt_clk]
connect_bd_net [get_bd_pins clk_wiz/locked] [get_bd_pins axis_red_pitaya_dac_0/locked]
connect_bd_net [get_bd_ports daisy_n_i] [get_bd_pins DAISY_BUF/daisy_n_i]
connect_bd_net [get_bd_ports daisy_p_i] [get_bd_pins DAISY_BUF/daisy_p_i]
connect_bd_net [get_bd_pins fifo_packet/prog_full] [get_bd_pins xlconcat_0/In4]
connect_bd_net -net processing_system7_0_FCLK_CLK0 [get_bd_pins PS/FCLK_CLK0] \
  [get_bd_pins CNTRL/s_axi_aclk] [get_bd_pins axi_mem_intercon/ACLK] [get_bd_pins axi_mem_intercon/S00_ACLK] \
  [get_bd_pins axi_mem_intercon/M00_ACLK] [get_bd_pins dma/s_axi_lite_aclk] [get_bd_pins dma/m_axi_s2mm_aclk] \
  [get_bd_pins fifo_packet/m_axis_aclk]
connect_bd_net -net rst_ps7_0_125M_peripheral_aresetn [get_bd_pins PS/S00_ARESETN] \
  [get_bd_pins CNTRL/s_axi_aresetn] [get_bd_pins axi_mem_intercon/ARESETN] [get_bd_pins axi_mem_intercon/S00_ARESETN] \
  [get_bd_pins axi_mem_intercon/M00_ARESETN] [get_bd_pins dma/axi_resetn]
connect_bd_net -net sequencer_0_generator_trigger [get_bd_pins CNTRL/gen1_trigger] [get_bd_pins xlconcat_0/In0]
connect_bd_net -net sequencer_accumulator_trigger [get_bd_pins CNTRL/accumulator_trigger] [get_bd_pins ACCUS/trigger] [get_bd_pins xlconcat_0/In2]
connect_bd_net -net sequencer_generator_sweep_trigger [get_bd_pins CNTRL/gen2_trigger] [get_bd_pins xlconcat_0/In1]
connect_bd_net -net util_ds_buf_0_IBUF_OUT [get_bd_pins clk_wiz/clk_out1] \
  [get_bd_pins MIXERS/aclk] [get_bd_pins ACCUS/aclk] [get_bd_pins CNTRL/aclk] [get_bd_pins RP_ADC/aclk] \
  [get_bd_pins axis_red_pitaya_dac_0/aclk] [get_bd_pins c_counter_binary_0/CLK] [get_bd_pins dds_if/aclk] \
  [get_bd_pins dds_ref/aclk] [get_bd_pins fifo_packet/s_axis_aclk] [get_bd_pins packetiser/aclk] \
  [get_bd_pins stretcher_0/aclk]
connect_bd_net -net util_ds_buf_2_OBUF_DS_N [get_bd_pins DAISY_BUF/daisy_n_o] [get_bd_ports daisy_n_o]
connect_bd_net -net util_ds_buf_2_OBUF_DS_P [get_bd_pins DAISY_BUF/daisy_p_o] [get_bd_ports daisy_p_o]
connect_bd_net [get_bd_pins xlconcat_0/dout] [get_bd_ports led_o] [get_bd_ports exp_p_tri_io]
connect_bd_net [get_bd_pins xlconcat_2/dout] [get_bd_pins RP_ADC/adc_dat_a]
connect_bd_net [get_bd_pins xlconcat_3/dout] [get_bd_pins RP_ADC/adc_dat_b]
connect_bd_net [get_bd_pins xlconstant_0/dout] [get_bd_ports exp_n_tri_io]
connect_bd_net [get_bd_pins xlconstant_2/dout] [get_bd_pins xlconcat_2/In1]
connect_bd_net -net xlconstant_2_dout1 [get_bd_pins xlconstant_3/dout] [get_bd_pins xlconcat_3/In1]
connect_bd_net -net xpm_cdc_gen_0_dest_out [get_bd_pins CNTRL/rst] \
  [get_bd_pins ACCUS/rst] [get_bd_pins fifo_packet/s_axis_aresetn] [get_bd_pins xlconcat_0/In3] [get_bd_pins packetiser/rst] \
  [get_bd_pins stretcher_0/rst]

# ---- address map ----
assign_bd_address -offset 0x00000000 -range 512M -target_address_space [get_bd_addr_spaces dma/Data_S2MM] [get_bd_addr_segs PS/processing_system7_0/S_AXI_HP0/HP0_DDR_LOWOCM]
assign_bd_address -offset 0x40400000 -range 64K -target_address_space [get_bd_addr_spaces PS/processing_system7_0/Data] [get_bd_addr_segs dma/S_AXI_LITE/Reg]
assign_bd_address -offset 0x41200000 -range 4K -target_address_space [get_bd_addr_spaces PS/processing_system7_0/Data] [get_bd_addr_segs CNTRL/mmio_config_2/S_AXI/Reg]
assign_bd_address -offset 0x42000000 -range 4K -target_address_space [get_bd_addr_spaces PS/processing_system7_0/Data] [get_bd_addr_segs CNTRL/mmio_config_1/S_AXI/Reg]

validate_bd_design
save_bd_design
